# EAGLE design inverted_pendulum_schematic (EAGLE 9.6.2)
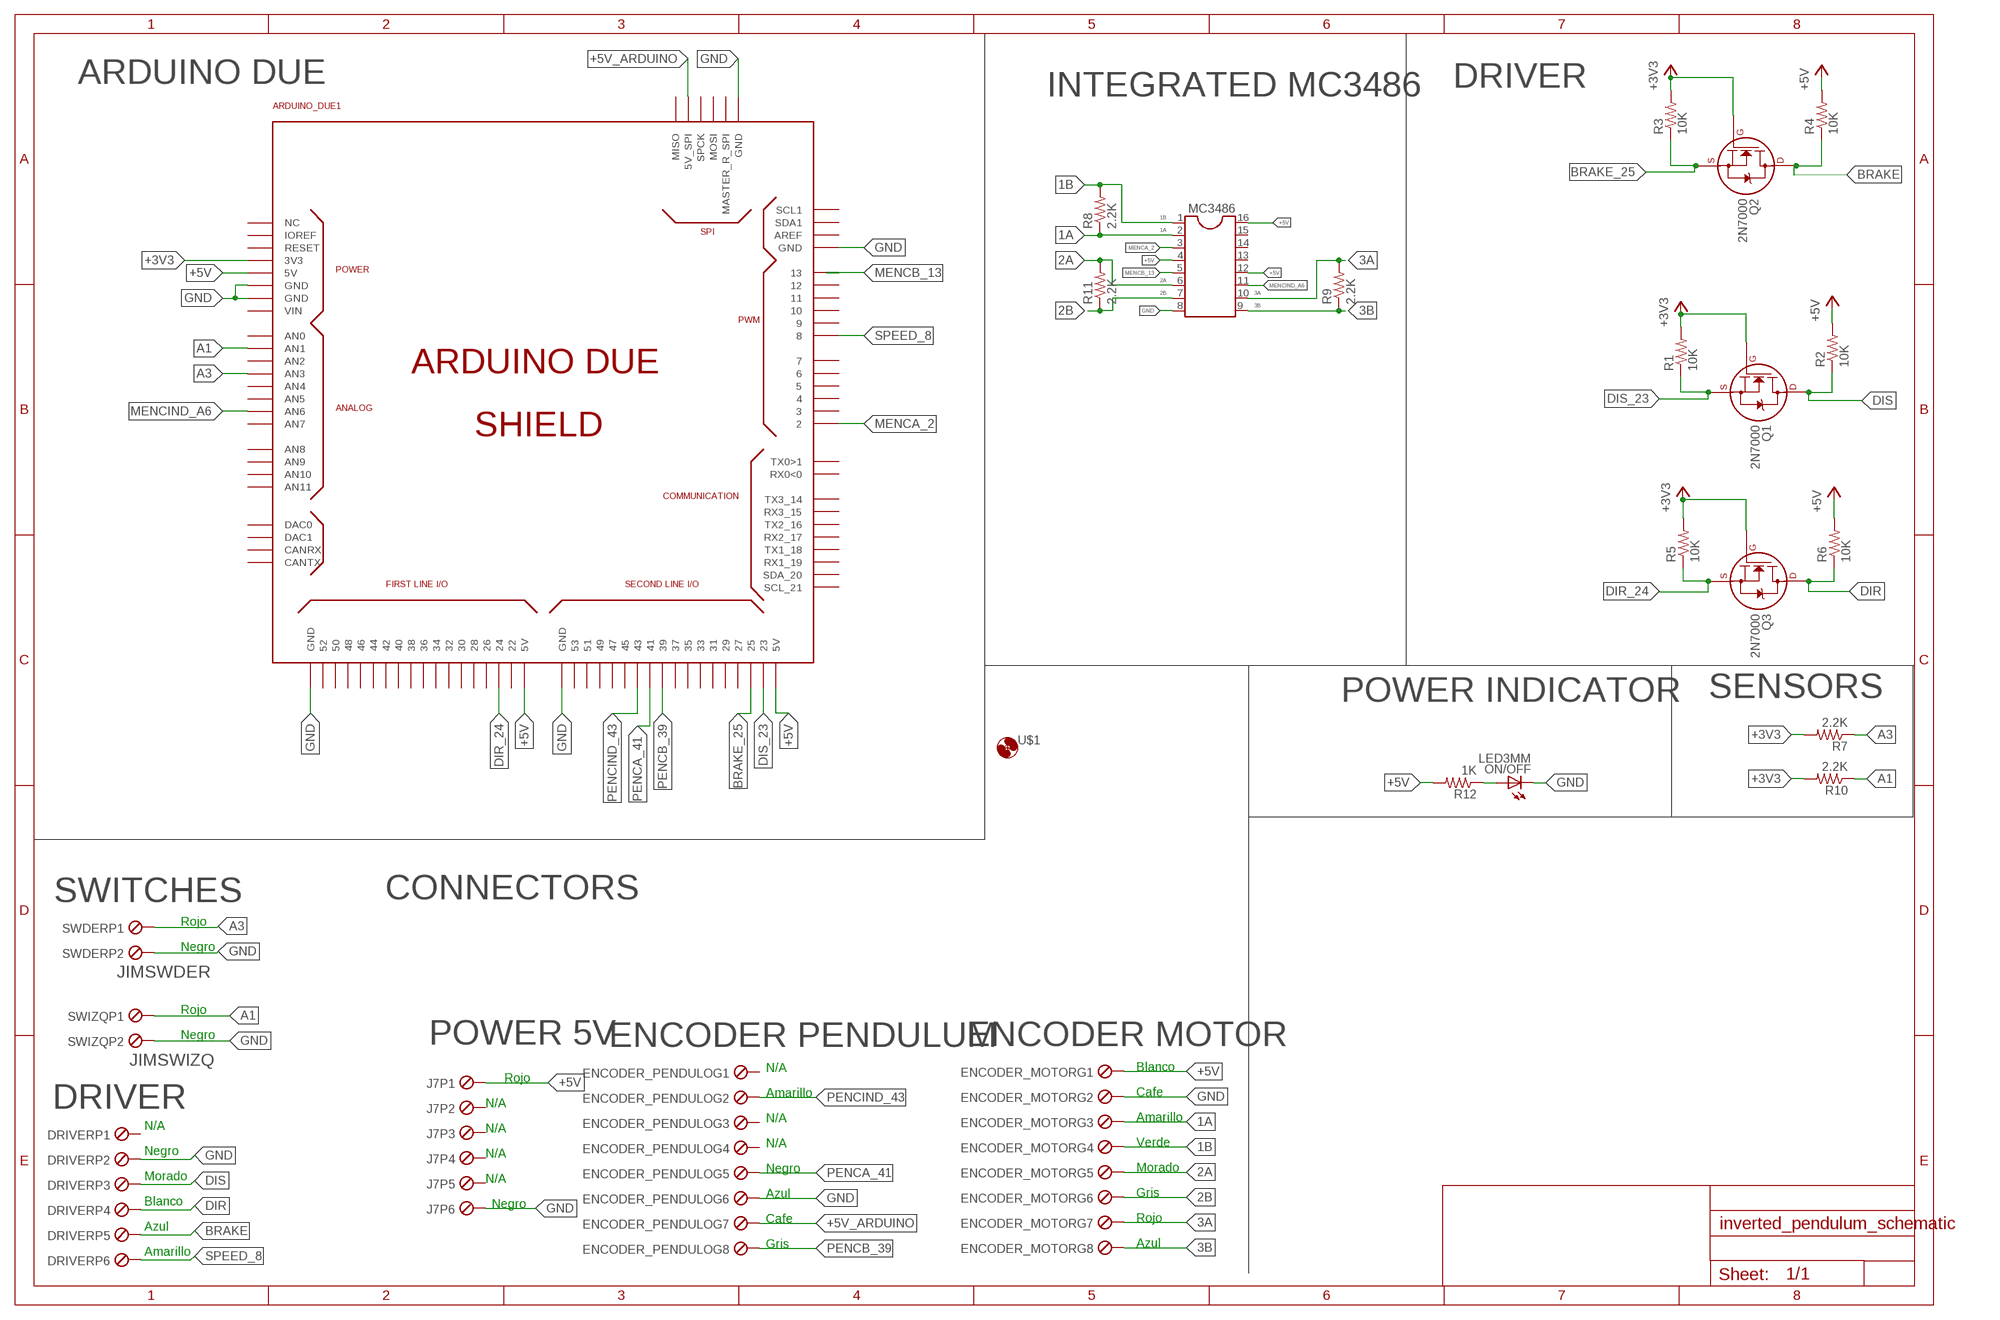
[diagram p0: schematic, sheet 1]

## Parts
ARDUINO_DUE1  ARDUINO_DUE_SHIELD  [ARDUINO_DUE_SHIELD]
DRIVER  PTSM1/6-2,50_TH  [6PTSMTH]
ENCODER_MOTOR  PTSM1/8-2,50_TH  [8PTSMTH]
ENCODER_PENDULO  PTSM1/8-2,50_TH  [8PTSMTH]
J7  PTSM1/6-2,50_TH  [6PTSMTH]
MC3486  DIL16S  [SOCKET-16]
ON/OFF  LED3MM  [LED3MM]
Q1  2N7000  2N7000_TO92  [TO-92]
Q2  2N7000  2N7000_TO92  [TO-92]
Q3  2N7000  2N7000_TO92  [TO-92]
R1  10K  R-US_0207/10  [0207/10]
R2  10K  R-US_0207/10  [0207/10]
R3  10K  R-US_0207/10  [0207/10]
R4  10K  R-US_0207/10  [0207/10]
R5  10K  R-US_0207/10  [0207/10]
R6  10K  R-US_0207/10  [0207/10]
R7  2.2K  R-US_0207/10  [0207/10]
R8  2.2K  R-US_0207/10  [0207/10]
R9  2.2K  R-US_0207/10  [0207/10]
R10  2.2K  R-US_0207/10  [0207/10]
R11  2.2K  R-US_0207/10  [0207/10]
R12  1K  R-US_0207/10  [0207/10]
SWDER  PTSM1/2-2,50_TH  [2PTSMTH]
SWIZQ  PTSM1/2-2,50_TH  [2PTSMTH]
U$1  FIDUCIAL  [ROLAND_1]

## Nets
1A: ENCODER_MOTOR.P$3 MC3486.2 R8.1
1B: ENCODER_MOTOR.P$4 MC3486.1 R8.2
2A: ENCODER_MOTOR.P$5 MC3486.6 R11.2
2B: ENCODER_MOTOR.P$6 MC3486.7 R11.1
3A: ENCODER_MOTOR.P$7 MC3486.10 R9.2
3B: ENCODER_MOTOR.P$8 MC3486.9 R9.1
+3V3: ARDUINO_DUE1.3V3 Q1.2(G) Q2.2(G) Q3.2(G) R1.2 R3.2 R5.2 R7.2 R10.2
+5V: ARDUINO_DUE1.5V0(5V) ARDUINO_DUE1.5V0_1(5V) ARDUINO_DUE1.5V0_2(5V) ENCODER_MOTOR.P$1 J7.P$1 MC3486.4 MC3486.12 MC3486.16 R2.2 R4.2 R6.2 R12.2
+5V_ARDUINO: ARDUINO_DUE1.5V_2(5V_SPI) ENCODER_PENDULO.P$7
A1: ARDUINO_DUE1.A1(AN1) R10.1 SWIZQ.1
A3: ARDUINO_DUE1.A3(AN3) R7.1 SWDER.1
BRAKE: DRIVER.P$5 Q2.3(D) R4.1
BRAKE_25: ARDUINO_DUE1.25 Q2.1(S) R3.1
DIR: DRIVER.P$4 Q3.3(D) R6.1
DIR_24: ARDUINO_DUE1.24 Q3.1(S) R5.1
DIS: DRIVER.P$3 Q1.3(D) R2.1
DIS_23: ARDUINO_DUE1.23 Q1.1(S) R1.1
GND: ARDUINO_DUE1.GND ARDUINO_DUE1.GND_1(GND) ARDUINO_DUE1.GND_2(GND) ARDUINO_DUE1.GND_3(GND) ARDUINO_DUE1.GND_4(GND) ARDUINO_DUE1.GND_5(GND) DRIVER.P$2 ENCODER_MOTOR.P$2 ENCODER_PENDULO.P$6 J7.P$6 MC3486.8 ON/OFF.K(C) SWDER.2 SWIZQ.2
MENCA_2: ARDUINO_DUE1.2 MC3486.3
MENCB_13: ARDUINO_DUE1.13 MC3486.5
MENCIND_A6: ARDUINO_DUE1.A6(AN6) MC3486.11
N$2: ON/OFF.A R12.1
PENCA_41: ARDUINO_DUE1.41 ENCODER_PENDULO.P$5
PENCB_39: ARDUINO_DUE1.39 ENCODER_PENDULO.P$8
PENCIND_43: ARDUINO_DUE1.43 ENCODER_PENDULO.P$2
SPEED_8: ARDUINO_DUE1.8 DRIVER.P$6
Unconnected: ARDUINO_DUE1.0(RX0<0) ARDUINO_DUE1.1(TX0>1) ARDUINO_DUE1.3 ARDUINO_DUE1.4 ARDUINO_DUE1.5 ARDUINO_DUE1.6 ARDUINO_DUE1.7 ARDUINO_DUE1.9 ARDUINO_DUE1.10 ARDUINO_DUE1.11 ARDUINO_DUE1.12 ARDUINO_DUE1.14(TX3_14) ARDUINO_DUE1.15(RX3_15) ARDUINO_DUE1.16(TX2_16) ARDUINO_DUE1.17(RX2_17) ARDUINO_DUE1.18(TX1_18) ARDUINO_DUE1.19(RX1_19) ARDUINO_DUE1.20(SDA_20) ARDUINO_DUE1.21(SCL_21) ARDUINO_DUE1.22 ARDUINO_DUE1.26 ARDUINO_DUE1.27 ARDUINO_DUE1.28 ARDUINO_DUE1.29 ARDUINO_DUE1.30 ARDUINO_DUE1.31 ARDUINO_DUE1.32 ARDUINO_DUE1.33 ARDUINO_DUE1.34 ARDUINO_DUE1.35 ARDUINO_DUE1.36 ARDUINO_DUE1.37 ARDUINO_DUE1.38 ARDUINO_DUE1.40 ARDUINO_DUE1.42 ARDUINO_DUE1.44 ARDUINO_DUE1.45 ARDUINO_DUE1.46 ARDUINO_DUE1.47 ARDUINO_DUE1.48 ARDUINO_DUE1.49 ARDUINO_DUE1.50 ARDUINO_DUE1.51 ARDUINO_DUE1.52 ARDUINO_DUE1.53 ARDUINO_DUE1.A0(AN0) ARDUINO_DUE1.A2(AN2) ARDUINO_DUE1.A4(AN4) ARDUINO_DUE1.A5(AN5) ARDUINO_DUE1.A7(AN7) ARDUINO_DUE1.A8(AN8) ARDUINO_DUE1.A9(AN9) ARDUINO_DUE1.A10(AN10) ARDUINO_DUE1.A11(AN11) ARDUINO_DUE1.AREF ARDUINO_DUE1.CANRX ARDUINO_DUE1.CANTX ARDUINO_DUE1.DAC0 ARDUINO_DUE1.DAC1 ARDUINO_DUE1.IOREF ARDUINO_DUE1.MASTER_RESET_SPI(MASTER_R_SPI) ARDUINO_DUE1.MISO ARDUINO_DUE1.MOSI ARDUINO_DUE1.NC_2(NC) ARDUINO_DUE1.RESET ARDUINO_DUE1.SCL1 ARDUINO_DUE1.SDA1 ARDUINO_DUE1.SPCK ARDUINO_DUE1.VIN DRIVER.P$1 ENCODER_PENDULO.P$1 ENCODER_PENDULO.P$3 ENCODER_PENDULO.P$4 J7.P$2 J7.P$3 J7.P$4 J7.P$5 MC3486.13 MC3486.14 MC3486.15

## Notes on the sheet
- ARDUINO DUE | DRIVER
- INTEGRATED MC3486
- POWER INDICATOR | SENSORS
- SWITCHES | CONNECTORS
- Rojo
- Negro
- JIMSWDER
- Rojo
- Negro
- POWER 5V | ENCODER PENDULUM | ENCODER MOTOR
- JIMSWIZQ
- N/A | Blanco
- Rojo
- Amarillo | Cafe
- DRIVER | N/A
- N/A | Amarillo
- N/A | N/A
- N/A | Verde
- Negro | N/A
- Negro | Morado
- Morado | N/A
- Azul | Gris
- Blanco | Negro
- Cafe | Rojo
- Azul
- Gris | Azul
- Amarillo

## Library data of the parts
ARDUINO_DUE1 = arduino_due_shield:ARDUINO_DUE_SHIELD
DRIVER J7 = 1 - con-phoenix:PTSM1/6-2,50_TH
ENCODER_MOTOR ENCODER_PENDULO = 1 - con-phoenix:PTSM1/8-2,50_TH
MC3486 = ic-package:DIL16: Dual In Line / Socket
ON/OFF = adafruit:LED: LED OSRAM: - CHIPLED LG R971, LG N971, LY N971, LG Q971, LY Q971, LO R971, LY R971 LH N974, LH R974 LS Q976, LO Q976, LY Q976 LO Q996 - Hyper CHIPLED LW Q18S LB Q993, LB Q99A, LB R99A - SideLED LS A670, LO A670, LY A670, LG A670, LP A670 LB A673, LV A673, LT A673, LW A673 LH A674 LY A675 LS A676, LA A676, LO A676, LY A676, LW A676 LS A679, LY A679, LG A679 - Hyper Micro SIDELED® LS Y876, LA Y876, LO Y876, LY Y876 LT Y87S - SmartLED LW L88C, LW L88S LB L89C, LB L89S, LG L890 LS L89K, LO L89K, LY L89K LS L896, LA L896, LO L896, LY L896 - TOPLED LS T670, LO T670, LY T670, LG T670, LP T670 LSG T670, LSP T670, LSY T670, LOP T670, LYG T670 LG T671, LOG T671, LSG T671 LB T673, LV T673, LT T673, LW T673 LH T674 LS T676, LA T676, LO T676, LY T676, LB T676, LH T676, LSB T676, LW T676 LB T67C, LV T67C, LT T67C, LS T67K, LO T67K, LY T67K, LW E67C LS E67B, LA E67B, LO E67B, LY E67B, LB E67C, LV E67C, LT E67C LW T67C LS T679, LY T679, LG T679 LS T770, LO T770, LY T770, LG T770, LP T770 LB T773, LV T773, LT T773, LW T773 LH T774 LS E675, LA E675, LY E675, LS T675 LS T776, LA T776, LO T776, LY T776, LB T776 LHGB T686 LT T68C, LB T68C - Hyper Mini TOPLED® LB M676 - Mini TOPLED Santana® LG M470 LS M47K, LO M47K, LY M47K Source: http://www.osram.convergy.de/
Q1-Q3 = transistors:2N700*: 2N7000, 2N7002, NDS7002A N-channel enhancement mode MOSFET
R1-R12 = resistor:R-US_: RESISTOR, American symbol
SWDER SWIZQ = 1 - con-phoenix:PTSM1/2-2,50_TH
U$1 = 0 - holes:FIDUCIAL

## Board
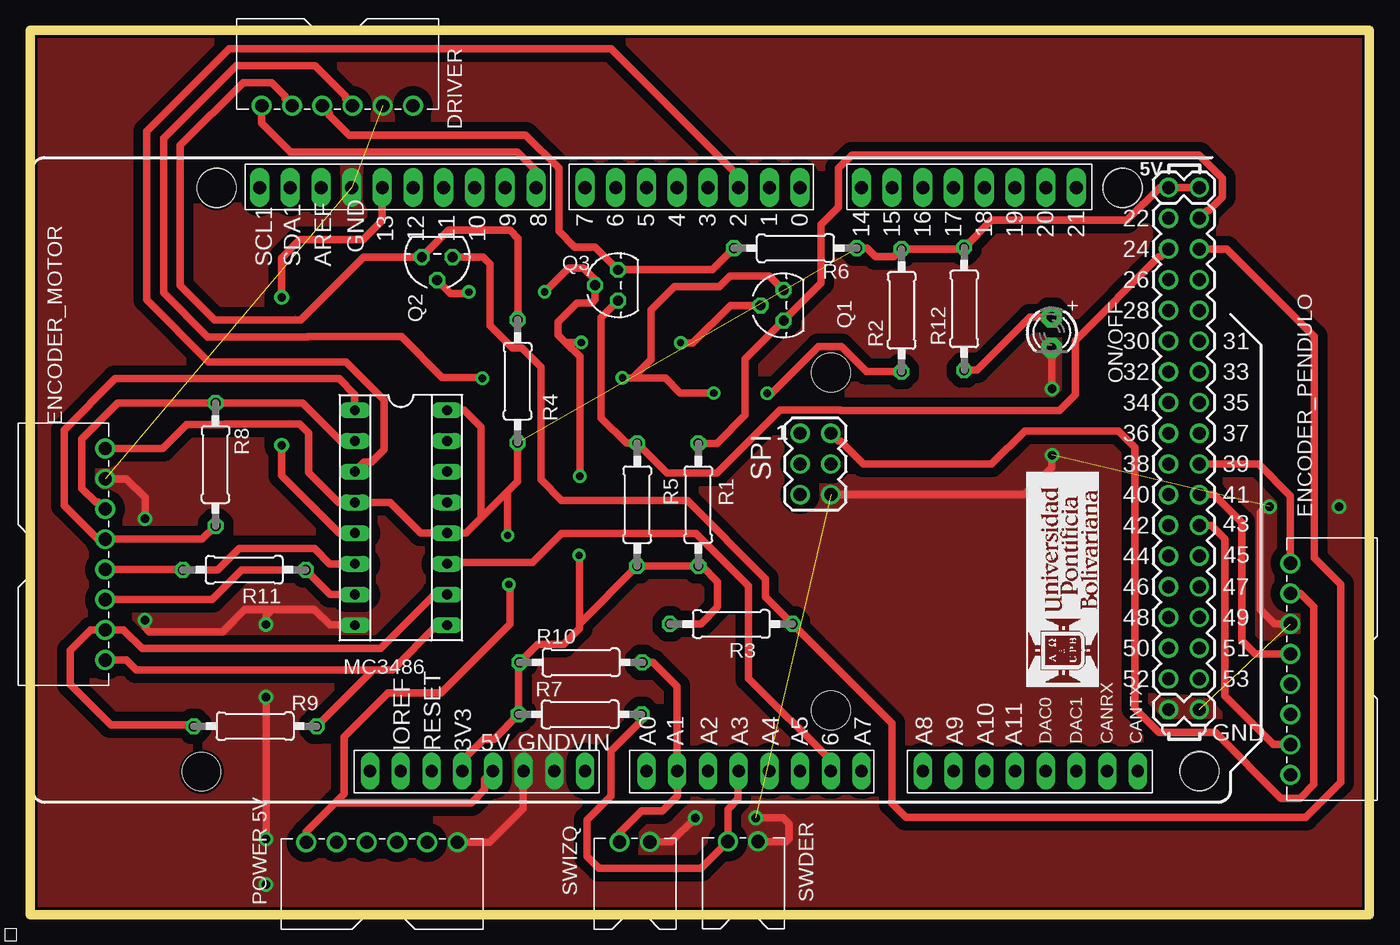
[diagram p1: board, top side]
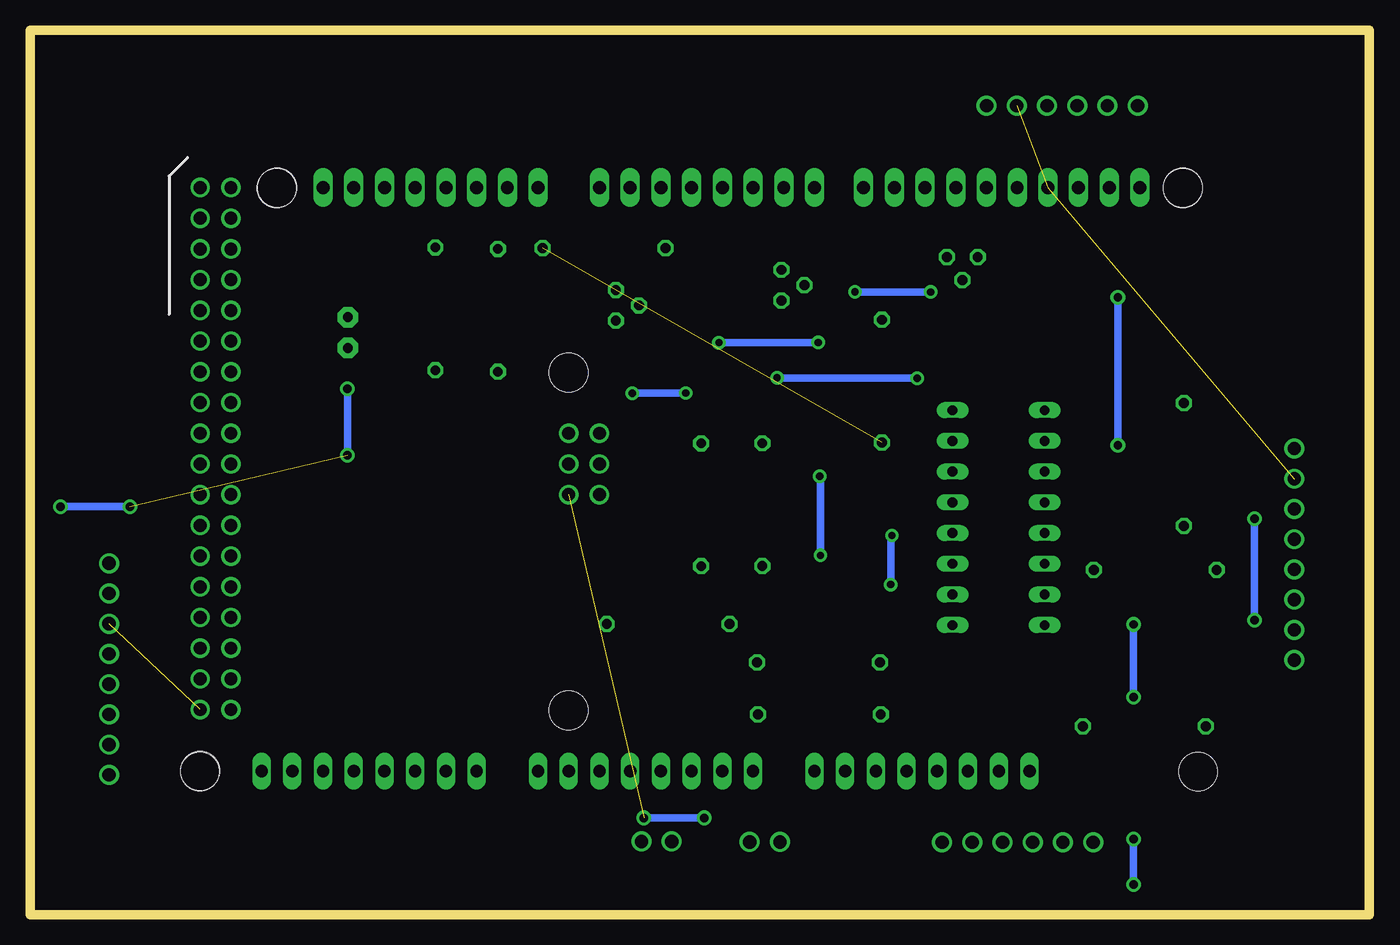
[diagram p2: board, bottom side, seen from below]

Size 110.74 x 73.15 mm. Coordinates in mm from the lower left corner, seen from the top.
Outline: 0,0 0,73.15 110.74,73.15 110.74,0 0,0
Copper layers (1+16): Top 0.017mm / dielectric 1.566mm / Bottom 0.017mm
Design rules "PrototipoRoboticaUPB": minimum track width 0.4mm, minimum drill 0.6mm, track to track 0.8mm, track to pad 0.8mm, pad to pad 0.8mm, via to via 0.8mm, smd to smd 0mil, copper to edge 0.22mm, drill to drill 10mil, minimum pad ring 10mil, minimum via ring 10mil, stop-mask expansion 4mil, vias tented up to drill 15mil, thermal gap 6mil

### Footprints (pad centres in the part's own frame; a part is rotated, then mirrored left to right if it is on the bottom)
ARDUINO_DUE_SHIELD = drill 1.067 pad 1.422 long: 0 63.373,51.816; 1 60.833,51.816; 2 58.293,51.816; 3 55.753,51.816; 4 53.213,51.816; 5 50.673,51.816; 6 48.133,51.816; 7 45.593,51.816; 8 41.529,51.816; 9 38.989,51.816; 10 36.449,51.816; 11 33.909,51.816; 12 31.369,51.816; 13 28.829,51.816; 14 68.453,51.816; 15 70.993,51.816; 16 73.533,51.816; 17 76.073,51.816; 18 78.613,51.816; 19 81.153,51.816; 20 83.693,51.816; 21 86.233,51.816; AREF 23.749,51.816; GND_4 26.289,51.816; SCL1 18.669,51.816; SDA1 21.209,51.816 | drill 1.016 pad 1.422 long: 3V3 35.433,3.556; 5V0 37.973,3.556; A0 50.673,3.556; A1 53.213,3.556; A2 55.753,3.556; A3 58.293,3.556; A4 60.833,3.556; A5 63.373,3.556; A6 65.913,3.556; A7 68.453,3.556; A8 73.533,3.556; A9 76.073,3.556; A10 78.613,3.556; A11 81.153,3.556; CANRX 88.773,3.556; CANTX 91.313,3.556; DAC0 83.693,3.556; DAC1 86.233,3.556; GND 40.513,3.556; GND_1 43.053,3.556; IOREF 30.346,3.543; NC_2 27.806,3.543; RESET 32.893,3.555; VIN 45.593,3.556 | drill 1.067 pad 1.422: 5V0_1 93.853,51.816; 5V0_2 96.393,51.816; 5V_2 65.913,31.496; 22 93.853,49.276; 23 96.393,49.276; 24 93.853,46.736; 25 96.393,46.736; 26 93.853,44.196; 27 96.393,44.196; 28 93.853,41.656; 29 96.393,41.656; 30 93.853,39.116; 31 96.393,39.116; 32 93.853,36.576; 33 96.393,36.576; 34 93.853,34.036; 35 96.393,34.036; 36 93.853,31.496; 37 96.393,31.496; 38 93.853,28.956; 39 96.393,28.956; 40 93.853,26.416; 41 96.393,26.416; 42 93.853,23.876; 43 96.393,23.876; 44 93.853,21.336; 45 96.393,21.336; 46 93.853,18.796; 47 96.393,18.796; 48 93.853,16.256; 49 96.393,16.256; 50 93.853,13.716; 51 96.393,13.716; 52 93.853,11.176; 53 96.393,11.176; GND_2 93.853,8.636; GND_3 96.393,8.636; GND_5 65.913,26.416; MASTER_RESET_SPI 63.373,26.416; MISO 63.373,31.496; MOSI 65.913,28.956; SPCK 63.373,28.956 | hole 3.2: 15.113,51.816; 90.043,51.816; 96.393,3.556; 96.418,3.505; 15.138,51.765; 90.068,51.765; 13.868,3.505; 65.938,36.525; 65.938,8.585
6PTSMTH = drill 1.1: P$1 -6.25,-0.305; P$2 -3.75,-0.305; P$3 -1.25,-0.305; P$4 1.25,-0.305; P$5 3.75,-0.305; P$6 6.25,-0.305
8PTSMTH = drill 1.1: P$1 -8.75,-0.3; P$2 -6.25,-0.3; P$3 -3.75,-0.3; P$4 -1.25,-0.3; P$5 1.25,-0.3; P$6 3.75,-0.3; P$7 6.25,-0.3; P$8 8.75,-0.3
SOCKET-16 = drill 0.813 long: 1 -8.89,-3.81; 2 -6.35,-3.81; 3 -3.81,-3.81; 4 -1.27,-3.81; 5 1.27,-3.81; 6 3.81,-3.81; 7 6.35,-3.81; 8 8.89,-3.81; 9 8.89,3.81; 10 6.35,3.81; 11 3.81,3.81; 12 1.27,3.81; 13 -1.27,3.81; 14 -3.81,3.81; 15 -6.35,3.81; 16 -8.89,3.81
LED3MM = drill 0.813 pad 1.676 octagon: A -1.27,0; K 1.27,0
TO-92 = drill 0.813 octagon: 1 -1.27,0; 2 0,1.905; 3 1.27,0
0207/10 = drill 0.813 octagon: 1 -5.08,0; 2 5.08,0
2PTSMTH = drill 1.1: 1 -2.423,3.315; 2 0.077,3.315

### Placement (x,y rotation side)
ARDUINO_DUE1  0.29,8.32 0 top
DRIVER  25.4,66.6 180 top
ENCODER_MOTOR  6.49,29.8 270 top
ENCODER_PENDULO  103.92,20.31 90 top
J7  29.08,6.29 0 top
MC3486  30.65,32.83 270 top
ON/OFF  84.48,48.14 270 top
Q1  62.31,50.39 90 top
Q2  33.66,54.39 180 top
Q3  48.63,52.06 90 top
R1  55.25,33.9 270 top
R2  72.07,49.98 90 top
R3  57.98,24.04 180 top
R4  40.31,44.12 270 top
R5  50.2,33.91 270 top
R6  63.28,55.12 0 top
R7  45.48,16.56 180 top
R8  15.32,37.23 270 top
R9  18.6,15.58 180 top
R10  45.55,20.86 180 top
R11  17.7,28.52 180 top
R12  77.24,50.11 90 top
SWDER  60.11,2.73 0 top
SWIZQ  51.16,2.69 0 top
U$1  -2.1,-2.17 0 top

### Tracks (layer width: path | path; a pad name or v marks a point on that pad's centre or on a via)
1A
  Top 0.6: MC3486.2 25.68,39.18 22.54,42.32 15.33,42.32 R8.1 7.23,42.31 4.27,39.35 4.27,35.25 5.4,34.12 5.62,34.12 ENCODER_MOTOR.P$3
1B
  Top 0.6: R8.2 14.22,31.05 ENCODER_MOTOR.P$4 5.56,31.05 2.79,33.82 2.79,40.07 7.04,44.32 25.54,44.32 26.84,43.02 MC3486.1
2A
  Top 0.6: ENCODER_MOTOR.P$5 12.59,28.55 R11.2 15.51,28.52 17.27,30.28 23.51,30.28 24.77,29.02 MC3486.6
2B
  Top 0.6: MC3486.7 24.82,26.48 R11.1 17.49,28.52 15.04,26.07 6.21,26.07 ENCODER_MOTOR.P$6
3A
  Top 0.6: MC3486.10 33.45,26.48 28.97,22 9.25,22 7.7,23.55 ENCODER_MOTOR.P$7 5.01,23.55 3.32,21.86 3.32,19.04 6.65,15.71 13.39,15.71 R9.2
3B
  Top 0.6: MC3486.9 33.66,23.94 29.97,20.25 28.35,20.25 | ENCODER_MOTOR.P$8 7.95,21.05 8.75,20.25 28.35,20.25 | R9.1 28.35,20.25
+3V3  (via drill 0.6)
  Top 0.6: ARDUINO_DUE1.3V3 35.73,12.73 37.49,14.5 38.34,14.5 R7.2 40.4,20.79 R10.2 41.96,22.35 44.12,22.35 45.42,23.65 45.42,24.05 | R3.2 55.46,24.04 56.86,25.44 56.86,27.53 55.57,28.82 R1.2 R5.2 45.42,24.05 | Q2.2 34.77,51.37 36.14,51.37 v36.27,51.5 | Q1.2 57.89,50.39 54.77,47.27 54,47.27 53.96,47.31 v53.79,47.31 | v42.54,51.51 44.51,53.48 45.78,53.48 46.72,52.54 Q3.2 46.72,50.86 46.45,50.59 45.22,50.59 43.66,49.03 43.66,47.94 44.28,47.32 | v45.57,47.32 44.28,47.32 | 45.42,24.05 45.42,29.53 45.39,29.56 v45.39,29.71 | v45.46,36.26 45.46,46.14 44.28,47.32
  Bottom 0.6: v36.27,51.5 42.47,51.5 42.51,51.46 42.54,51.49 v42.54,51.51 | v53.79,47.31 45.93,47.31 45.92,47.32 v45.57,47.32 | v45.39,29.71 45.39,36.04 45.46,36.11 v45.46,36.26
+5V  (via drill 0.6)  (1 unrouted)
  Top 0.6: MC3486.12 32.29,31.57 29.76,34.1 MC3486.4 25.51,34.1 23.04,36.57 23.04,39.82 22.29,40.57 16.07,40.57 16.05,40.55 12.94,40.55 10.94,38.55 ENCODER_MOTOR.P$1 | MC3486.12 | MC3486.16 35.89,41.72 37.29,40.32 37.29,32.82 | 37.29,32.82 36.04,31.57 MC3486.12 | ARDUINO_DUE1.5V0 37.59,11.2 37.59,10.34 36.48,9.24 25.21,9.24 | 25.21,9.24 22.83,6.86 J7.P$1 22.79,5.95 | ARDUINO_DUE1.5V0_2 ARDUINO_DUE1.5V0_1 93.41,60.14 90.71,57.44 79.49,57.44 R12.2 | R12.2 77.18,55.12 | R12.2 77.11,55.06 R2.2 71.43,54.42 69.89,54.42 69.19,55.12 R6.2 | R4.2 40.31,35.83 39.48,35.01 | 39.48,35.01 37.29,32.82 | 25.21,9.24 25.95,9.98 25.95,14.71 29.58,18.34 33.96,18.34 39.68,24.06 39.68,27.04 39.58,27.14 v39.58,27.3 | v39.48,31.36 39.48,35.01
  Bottom 0.6: v39.48,31.36 39.58,31.26 v39.58,27.3
+5V_ARDUINO
  Top 0.6: ENCODER_PENDULO.P$7 105.05,26.56 106.15,25.47 106.15,10.76 105.02,9.63 103.43,9.63 98.01,15.06 93.36,15.06 91.34,17.07 91.34,38.66 90,40 82.25,40 79.5,37.25 68.92,37.25 66.99,39.18 66.85,39.18 ARDUINO_DUE1.5V_2
A1
  Top 0.6: R10.1 51.5,20.86 53.51,18.86 ARDUINO_DUE1.A1 53.54,11.84 53.54,9.82 52.29,8.57 50.54,8.57 48.74,6.77 SWIZQ.1
A3
  Top 0.6: R7.1 50.56,16.07 48.04,13.55 48.04,9.82 46.04,7.82 46.04,4.82 47.04,3.82 55.47,3.82 SWDER.1 57.69,8.72 58.54,9.57 58.54,11.83 ARDUINO_DUE1.A3
BRAKE
  Top 0.6: DRIVER.P$5 21.08,67.48 21.08,67.7 19.95,68.83 17.6,68.83 12.42,63.65 12.42,52.01 15.25,49.18 22.35,49.18 27.56,54.39 Q2.3 34.6,56.6 39.67,56.6 40.37,55.9 40.37,49.26 R4.1
BRAKE_25
  Top 0.6: Q2.1 37.45,54.39 38.03,53.81 38.03,48.71 39.89,46.85 40.66,46.85 42.23,45.28 42.23,35.97 43.95,34.25 54.34,34.25 60.82,27.77 60.82,26.28 R3.1 71.27,15.83 71.27,9.19 72.41,8.05 105.51,8.05 108.4,10.94 108.4,27.3 106.18,29.52 106.18,47.83 98.96,55.06 ARDUINO_DUE1.25
DIR
  Top 0.6: DRIVER.P$4 24.73,66.33 24.73,66.11 26.37,64.47 40.98,64.47 43.72,61.72 43.72,56.52 45.03,55.21 46.7,55.21 48.58,53.33 Q3.3 56.41,53.33 R6.1
DIR_24
  Top 0.6: ARDUINO_DUE1.24 93.51,54.42 93.36,54.42 86.42,47.48 86.42,43.01 85.12,41.71 67,41.71 66.99,41.72 62.01,41.72 56.82,36.53 52.66,36.53 R5.1 49.31,38.99 47.22,41.08 47.22,49.38 Q3.1
DIS  (via drill 0.6)
  Top 0.6: DRIVER.P$3 26.08,67.48 26.08,67.7 23.55,70.23 17.02,70.23 11.02,64.23 11.02,51.43 14.67,47.78 22.93,47.78 22.95,47.8 30.7,47.8 34.06,44.44 36.95,44.44 36.96,44.43 37.32,44.43 v37.38,44.37 | Q1.3 61.15,52.83 57.88,52.83 56.99,51.93 53.28,51.93 51.35,50 51.35,45.89 49.83,44.37 | R2.1 69.18,44.9 67.11,46.96 65.18,46.96 61.34,43.13 v60.95,43.13 | v56.54,43.14 53.75,43.14 52.52,44.37 49.83,44.37 | 49.83,44.37 49.01,44.37 v48.98,44.4
  Bottom 0.6: v48.98,44.4 37.41,44.4 v37.38,44.37 | v60.95,43.13 v60.94,43.14 v56.54,43.14
DIS_23
  Top 0.6: ARDUINO_DUE1.23 97.33,58.24 97.47,58.24 98.59,59.35 98.59,60.92 96.67,62.84 67.96,62.84 66.85,61.72 66.85,58.52 65.42,57.09 65.42,52.23 Q1.1 59.13,45.94 59.13,41.32 56.79,38.98 R1.1
GND  (via drill 0.7)  (5 unrouted)
  Top 0.6: ENCODER_PENDULO.P$6 102.94,24.06 101.75,25.25 101.75,33.25 102.25,33.75 v102.5,33.75 | J7.P$6 37.98,5.98 40.75,8.75 40.75,11.82 ARDUINO_DUE1.GND | SWIZQ.2 53,6.01 v55,8 | v60,8 62.25,8 62.75,7.5 62.75,6.25 62.5,6 60.24,6 SWDER.2 | ARDUINO_DUE1.GND_5 82.24,34.74 84.5,37 v84.5,38 | MC3486.8 24.81,23.94 23.5,25.25 20,25.25 | v19.5,18 v19.5,6.25 | v19.5,24 19.5,24.75 20,25.25 | ENCODER_MOTOR.P$2 7.95,36.05 9.5,34.5 v9.5,32.75 | v9.5,24.37 9.5,23.75 9.85,23.4 15.9,23.4 17.75,25.25 20,25.25 | ON/OFF.K 84.5,46.85 v84.5,43.5
  Bottom 0.6: v102.5,33.75 v108.25,33.75 | v55,8 v60,8 | v84.5,38 v84.5,43.5 | v19.5,24 v19.5,18 | v19.5,6.25 v19.5,2.5 | v9.5,32.75 v9.5,24.37 9.5,24.25
  pour Top (no thermals): 0.1,73 0.1,0.25 0.25,0.1 109.73,0.1 110.44,-0.61 110.44,72.8 110.24,73
MENCA_2
  Top 0.6: MC3486.3 27.62,37.42 28.23,37.42 29.26,38.45 29.26,42.58 26.12,45.72 14.75,45.72 9.62,50.85 9.62,64.81 16.44,71.63 48.04,71.63 58.45,61.22 58.65,61.22 58.59,61.16 ARDUINO_DUE1.2
MENCB_13  (via drill 0.7)
  Top 0.6: MC3486.5 25.55,31.56 20.79,36.32 v20.79,38.82 | ARDUINO_DUE1.13 29.12,57.4 27.54,55.82 22.29,55.82 20.79,54.32 v20.79,51.07
  Bottom 0.6: v20.79,38.82 v20.79,51.07
MENCIND_A6
  Top 0.6: ARDUINO_DUE1.A6 66.21,12.76 59.42,19.55 59.42,27.19 55.08,31.53 43.93,31.53 41.53,29.13 34.57,29.13 MC3486.11
N$2
  Top 0.6: ON/OFF.A 82.68,49.41 78.3,45.03 R12.1
PENCA_41
  Top 0.6: ENCODER_PENDULO.P$5 101.3,21.56 100.19,22.67 100.19,32.42 97.88,34.74 ARDUINO_DUE1.41
PENCB_39
  Top 0.6: ARDUINO_DUE1.39 101.59,37.28 104.22,34.64 ENCODER_PENDULO.P$8
PENCIND_43
  Top 0.6: ENCODER_PENDULO.P$2 102.8,14.06 98.79,18.07 98.79,31.07 97.67,32.2 ARDUINO_DUE1.43
SPEED_8
  Top 0.6: DRIVER.P$6 19.15,65.46 21.54,63.07 40.29,63.07 42.04,61.32 42.04,60.36 ARDUINO_DUE1.8

### Text on the board
tPlace: POWER 5V